# EAGLE design OpenScale (EAGLE 7.2.0)
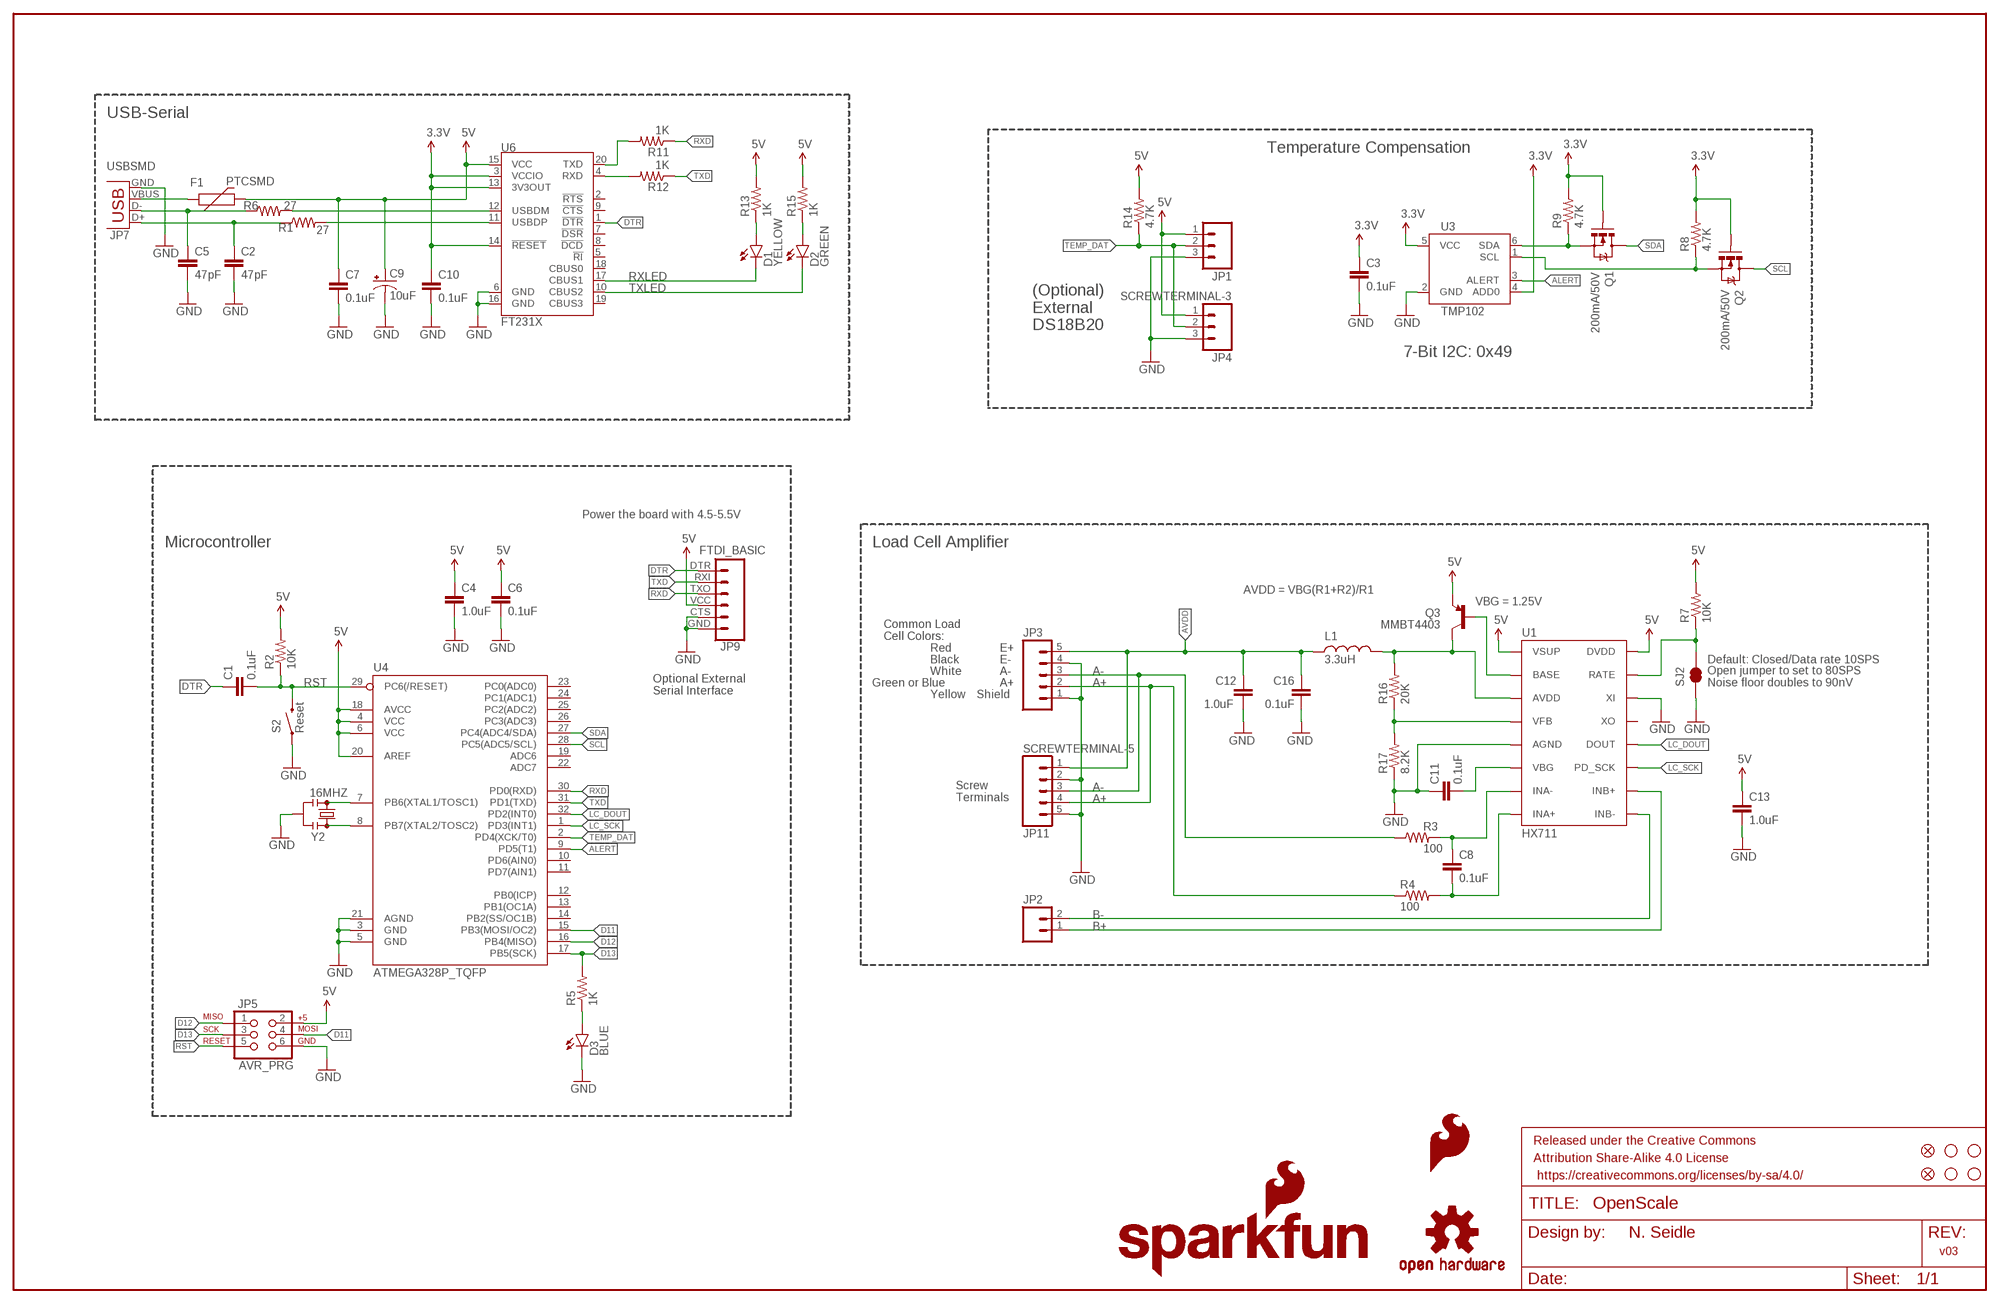
[diagram p0: schematic, sheet 1]

## Parts
C1  0.1uF  0.1UF-25V(+80/-20%)(0603)  [0603-CAP]
C2  47pF  47PF-50V-5%(0603)  [0603-CAP]
C3  0.1uF  0.1UF-25V(+80/-20%)(0603)  [0603-CAP]
C4  1.0uF  1.0UF-16V-10%(0603)  [0603-CAP]
C5  47pF  47PF-50V-5%(0603)  [0603-CAP]
C6  0.1uF  0.1UF-25V(+80/-20%)(0603)  [0603-CAP]
C7  0.1uF  0.1UF-25V(+80/-20%)(0603)  [0603-CAP]
C8  0.1uF  0.1UF-25V(+80/-20%)(0603)  [0603-CAP]
C9  10uF  10UF-16V-10%(TANT)  [EIA3216]
C10  0.1uF  0.1UF-25V(+80/-20%)(0603)  [0603-CAP]
C11  0.1uF  0.1UF-25V(+80/-20%)(0603)  [0603-CAP]
C12  1.0uF  1.0UF-16V-10%(0603)  [0603-CAP]
C13  1.0uF  1.0UF-16V-10%(0603)  [0603-CAP]
C16  0.1uF  0.1UF-25V(+80/-20%)(0603)  [0603-CAP]
D1  YELLOW  LED-YELLOWLARGE  [LED-1206]
D2  GREEN  LED-GREENLARGE  [LED-1206]
D3  BLUE  LED-BLUE1206  [LED-1206]
F1  PTCSMD  [PTC-1206]
FID1  FIDUCIAL1X2  [FIDUCIAL-1X2]
FID2  FIDUCIAL1X2  [FIDUCIAL-1X2]
FRAME1  FRAME-LEDGER  [CREATIVE_COMMONS]
JP1  M031X03_NO_SILK  [1X03_NO_SILK]
JP2  M02PTH  [1X02]
JP3  M05NO_SILK  [1X05_NO_SILK]
JP4  SCREWTERMINAL-3  M03SCREW_LOCK  [SCREWTERMINAL-3.5MM-3_LOCK.007S]
JP5  AVR_PRG  AVR_SPI_PRG_6PTH  [2X3]
JP7  USBSMD  [USB-MINIB]
JP9  FTDI_BASIC  FTDI_BASICPTH  [FTDI_BASIC]
JP11  SCREWTERMINAL-5  M05SCREW  [SCREWTERMINAL-3.5MM-5]
L1  3.3uH  INDUCTOR0805  [0805]
LOGO1  SFE_LOGO_NAME_FLAME.1_INCH  [SFE_LOGO_NAME_FLAME_.1]
LOGO2  OSHW-LOGOS  [OSHW-LOGO-S]
LOGO3  SFE_LOGO_FLAME.1_STOP  [SFE_LOGO_FLAME_STOP_.1]
LOGO4  SFE_LOGO_NAME_FLAME.1_INCH  [SFE_LOGO_NAME_FLAME_.1]
Q1  200mA/50V  MOSFET-NCHANNELBSS138  [SOT23-3]
Q2  200mA/50V  MOSFET-NCHANNELBSS138  [SOT23-3]
Q3  MMBT4403  TRANSISTOR_PNPMMBT4403  [SOT23-3]
R1  27  27OHM1/10W1%(0603)  [0603]
R2  10K  10KOHM-1/10W-1%(0603)0603  [0603-RES]
R3  100  100OHM-1/10W-1%(0603)  [0603-RES]
R4  100  100OHM-1/10W-1%(0603)  [0603-RES]
R5  1K  1KOHM-1/10W-1%(0603)  [0603-RES]
R6  27  27OHM1/10W1%(0603)  [0603]
R7  10K  10KOHM-1/10W-1%(0603)0603  [0603-RES]
R8  4.7K  4.7KOHM-1/10W-1%(0603)  [0603-RES]
R9  4.7K  4.7KOHM-1/10W-1%(0603)  [0603-RES]
R11  1K  1KOHM-1/10W-1%(0603)  [0603-RES]
R12  1K  1KOHM-1/10W-1%(0603)  [0603-RES]
R13  1K  1KOHM-1/10W-1%(0603)  [0603-RES]
R14  4.7K  4.7KOHM-1/10W-1%(0603)  [0603-RES]
R15  1K  1KOHM-1/10W-1%(0603)  [0603-RES]
R16  20K  20KOHM1/10W1%(0603)  [0603-RES]
R17  8.2K  8.2KOHM-1/10W-5%(0603)  [0603-RES]
S2  Reset  SWITCH-MOMENTARY-2SMD-1101NE  [TACTILE-SWITCH-1101NE]
SJ2  JUMPER-PAD-2-NC_BY_TRACE  [PAD-JUMPER-2-NC_BY_TRACE_YES_SILK]
STANDOFF1  STAND-OFF  [STAND-OFF]
STANDOFF2  STAND-OFF  [STAND-OFF]
STANDOFF3  STAND-OFF  [STAND-OFF]
STANDOFF4  STAND-OFF  [STAND-OFF]
U1  HX711  HX711HX711  [SO16]
U3  TMP102  [SOT563]
U4  ATMEGA328P_TQFP  [TQFP32-08]
U6  FT231X  FT231XS  [SSOP20_L]
Y2  16MHZ  RESONATOR16MHZ  [RESONATOR-SMD]

## Nets
3.3V [power]: C3.1 C10.1 Q1.1(G) Q2.1(G) R8.2 R9.2 U3.4(ADD0) U3.5(VCC) U6.3(VCCIO) U6.13(3V3OUT) U6.14(!RESET)
5V: C4.1 C6.1 C7.1 C9.A(+) C13.1 F1.2 JP1.1 JP4.1 JP5.2 JP9.VCC Q3.2(E) R2.2 R7.2 R13.2 R14.2 R15.2 U1.1(VSUP) U1.16(DVDD) U4.4(VCC) U4.6(VCC) U4.18(AVCC) U4.20(AREF) U6.15(VCC)
A+: JP3.2 JP11.4 R4.1
A-: JP3.3 JP11.3 R3.1
ALERT: U3.3(ALERT) U4.9(PD5(T1))
AVDD: C12.2 C16.1 JP3.5 JP11.1 L1.1
B+: JP2.1 U1.10(INB+)
B-: JP2.2 U1.9(INB-)
D11: JP5.4 U4.15(PB3(MOSI/OC2))
D12: JP5.1 U4.16(PB4(MISO))
D13: JP5.3 R5.2 U4.17(PB5(SCK))
DTR: C1.1 JP9.DTR U6.1(!DTR)
GND [power]: C2.2 C3.2 C4.2 C5.2 C6.2 C7.2 C9.C(-) C10.2 C11.1 C12.1 C13.2 C16.2 D3.C JP1.3 JP3.1 JP3.4 JP4.3 JP5.6 JP7.GND JP9.CTS JP9.GND JP11.2 JP11.5 R17.1 S2.1 SJ2.1 U1.5(AGND) U1.14(XI) U3.2(GND) U4.3(GND) U4.5(GND) U4.21(AGND) U6.6(GND) U6.16(GND) Y2.2
LC_DOUT: U1.12(DOUT) U4.32(PD2(INT0))
LC_SCK: U1.11(PD_SCK) U4.1(PD3(INT1))
LV_SCL: Q2.2(S) R8.1 U3.1(SCL)
LV_SDA: Q1.2(S) R9.1 U3.6(SDA)
N$1: U4.7(PB6(XTAL1/TOSC1)) Y2.1
N$2: D3.A R5.1
N$3: U4.8(PB7(XTAL2/TOSC2)) Y2.3
N$4: C5.1 JP7.D- R6.1
N$5: D1.A R13.1
N$6: D2.A R15.1
N$7: C2.1 JP7.D+ R1.1
N$8: R6.2 U6.12(USBDM)
N$9: R7.1 SJ2.2 U1.15(RATE)
N$10: C8.1 R3.2 U1.7(INA-)
N$11: C8.2 R4.2 U1.8(INA+)
N$12: F1.1 JP7.VBUS
N$13: R1.2 U6.11(USBDP)
N$14: R12.2 U6.4(RXD)
N$15: L1.2 Q3.3(C) R16.2 U1.3(AVDD)
N$16: R11.2 U6.20(TXD)
N$17: Q3.1(B) U1.2(BASE)
N$18: R16.1 R17.2 U1.4(VFB)
N$21: C11.2 U1.6(VBG)
RST: C1.2 JP5.5 R2.1 S2.2 U4.29(PC6(/RESET))
RXD: JP9.TXO R11.1 U4.30(PD0(RXD))
RXLED: D1.C U6.17(CBUS1)
SCL: Q2.3(D) U4.28(PC5(ADC5/SCL))
SDA: Q1.3(D) U4.27(PC4(ADC4/SDA))
TEMP_DAT: JP1.2 JP4.2 R14.1 U4.2(PD4(XCK/T0))
TXD: JP9.RXI R12.1 U4.31(PD1(TXD))
TXLED: D2.C U6.10(CBUS2)
Unconnected: U1.13(XO) U4.10(PD6(AIN0)) U4.11(PD7(AIN1)) U4.12(PB0(ICP)) U4.13(PB1(OC1A)) U4.14(PB2(SS/OC1B)) U4.19(ADC6) U4.22(ADC7) U4.23(PC0(ADC0)) U4.24(PC1(ADC1)) U4.25(PC2(ADC2)) U4.26(PC3(ADC3)) U6.2(!RTS) U6.5(!RI) U6.7(!DSR) U6.8(!DCD) U6.9(!CTS) U6.18(CBUS0) U6.19(CBUS3)

## Notes on the sheet
- USB-Serial
- Temperature Compensation
- (Optional)
  External
  DS18B20
- 7-Bit I2C: 0x49
- Power the board with 4.5-5.5V
- Microcontroller | Load Cell Amplifier
- AVDD = VBG(R1+R2)/R1
- VBG = 1.25V
- Common Load
  Cell Colors:
- Red | E+
- Black | E- | Default: Closed/Data rate 10SPS
- White | A-
- Green or Blue | A+
- Open jumper to set to 80SPS
  Noise floor doubles to 90nV
- Optional External
  Serial Interface
- Yellow | Shield
- Screw
  Terminals
- N. Seidle
- v03

## Library data of the parts
C1 C3 C6-C8 C10 C11 C16 = SparkFun-Capacitors:0.1UF-25V(+80/-20%)(0603): CAP-00810 Ceramic Standard decoupling cap; PROD_ID: CAP-00810
C2 C5 = SparkFun-Capacitors:47PF-50V-5%(0603): CAP-08913; PROD_ID: CAP-08913
C4 C12 C13 = SparkFun-Capacitors:1.0UF-16V-10%(0603): CAP-00868; PROD_ID: CAP-00868
C9 = SparkFun-Capacitors:10UF-16V-10%(TANT): CAP-00811 1206/EIA-3216 Tantalum capacitor; PROD_ID: CAP-00811
D1 = SparkFun-LED:LED-YELLOW: Yellow SMD LEDs LilyPad 1206- DIO-09909 0603- DIO-09003 "SMART" means more efficient and expensive; PROD_ID: DIO-00820
D2 = SparkFun-LED:LED-GREEN: Various green LEDs Green LEDs used in SFE Production 0603- DIO-00821 LARGE- DIO-00862 LILYPAD- DIO-09910; PROD_ID: DIO-00862
D3 = SparkFun-LED:LED-BLUE: Blue LEDs for production use Various blue LEDs stocked by SparkFun production 0603 - DIO-08575 Rebel - DIO-09553 1206 - DIO-09911; PROD_ID: DIO-09911
F1 = SparkFun-PowerIC:PTC: Resettable Fuse PTC Resettable Fuse. Spark Fun Electronics SKU : COM-08357; PROD_ID: RES-11150
FID1 FID2 = SparkFun-Aesthetics:FIDUCIAL: Fiducial Alignment Points Various fiducial points for machine vision alignment.
FRAME1 = SparkFun-Aesthetics:FRAME-LEDGER: Schematic Frame Standard 11x14 US Ledger frame; DESIGNER: N. Seidle; VERSION: v02
JP1 = SparkFun-Connectors:M03: Header 3 Standard 3-pin 0.1" header. Use with straight break away headers (SKU : PRT-00116), right angle break away headers (PRT-00553), swiss pins (PRT-00743), machine pins (PRT-00117), and female headers (PRT-00115). Molex polarized connector foot print use with SKU : PRT-08232 with associated crimp pins and housings.
JP2 = SparkFun-Connectors:M02: Standard 2-pin 0.1" header. Use with - straight break away headers ( PRT-00116) - right angle break away headers (PRT-00553) - swiss pins (PRT-00743) - machine pins (PRT-00117) - female headers (PRT-00115) Molex polarized connector foot print use with: PRT-08233 with associated crimp pins and housings. 2.54_SCREWTERM for use with PRT-10571. 3.5mm Screw Terminal footprints for PRT-08084 5mm Screw Terminal footprints for use with PRT-08432
JP3 = SparkFun-Connectors:M05: Header 5 Standard 5-pin 0.1" header. Use with straight break away headers (SKU : PRT-00116), right angle break away headers (PRT-00553), swiss pins (PRT-00743), machine pins (PRT-00117), and female headers (PRT-00115). Molex polarized connector foot print use with SKU : PRT-08230 with associated crimp pins and housings.
JP4 = SparkFun-Connectors:M03: Header 3 Standard 3-pin 0.1" header. Use with straight break away headers (SKU : PRT-00116), right angle break away headers (PRT-00553), swiss pins (PRT-00743), machine pins (PRT-00117), and female headers (PRT-00115). Molex polarized connector foot print use with SKU : PRT-08232 with associated crimp pins and housings.; PROD_ID: CONN-08288
JP5 = SparkFun-Connectors:AVR_SPI_PRG_6: AVR ISP 6 Pin This is the reduced ISP connector for AVR programming. Common on Arduino. This footprint will take up less PCB space and can be used with a 10-pin to 6-pin adapter such as SKU: BOB-08508 **Special note about "TEST_POINT" package. The stop mask is on the top side, so if you want your programming test points to be on the bottom of your board, make sure to place this package on the bottom side of the board. This also ensure that the orientation to program from the bottom side will be correct.
JP7 = SparkFun-Connectors:USB: USB Connectors USB-B-PTH is fully proven SKU : PRT-00139/CONN-08278 USB-miniB is fully proven SKU : PRT-00587 USB-A-PCB is untested. USB-A-H is throughly reviewed, but untested. Spark Fun Electronics SKU : PRT-00437 USB-B-SMT is throughly reviewed, but untested. Needs silkscreen touching up. USB-A-S has not been used/tested USB-MB-H has not been used/tested USB-MICROB has been used. CONN-09505; PROD_ID: CONN-08193
JP9 = SparkFun-Connectors:FTDI_BASIC: FTDI Basic header with labels
JP11 = SparkFun-Connectors:M05: Header 5 Standard 5-pin 0.1" header. Use with straight break away headers (SKU : PRT-00116), right angle break away headers (PRT-00553), swiss pins (PRT-00743), machine pins (PRT-00117), and female headers (PRT-00115). Molex polarized connector foot print use with SKU : PRT-08230 with associated crimp pins and housings.; PROD_ID: Combine 8288+8399
L1 = SparkFun-Passives:INDUCTOR: Inductors Basic Inductor/Choke - 0603 and 1206. Footprints are not proven and vary greatly between part numbers. INDUCTOR POWER 3.3UH 4.0A SMD 0.197" L x 0.197" W x 0.177" H (5.00mm x 5.00mm x 4.50mm)
LOGO1 LOGO4 = SparkFun-Aesthetics:SFE_LOGO_NAME_FLAME: SFE Logo, name and flame This is the SparkFun full logo. The logo on the schematic will always be the same size; the package variant is the height of the flame part of the logo. Default layer for the logo on the board is tSilk.
LOGO2 = SparkFun-Aesthetics:OSHW-LOGO: Open Source Hardware Logo This logo indicates the piece of hardware it is found on incorporates a OSHW license and/or adheres to the definition of open source hardware found here: http://freedomdefined.org/OSHW
LOGO3 = SparkFun-Aesthetics:SFE_LOGO_FLAME: SFE Logo, flame only This is the SparkFun flame logo. The logo on the schematic will always be the same size; the package variant is the height of the flame. Default layer for the logo on the board is tSilk.
Q1 Q2 = SparkFun-DiscreteSemi:MOSFET-NCHANNEL: Common NMOSFET Parts MFG P/N Store ID Prod ID FDD8780 TRANS-09984 SI7820DN TRANS-11055 FDS6630A IC-08089 2N7002PW TRANS-11151 FQP30N06L COM-10213 TRANS-10060 BSS123LT1G TRANS-08345 BSS138 TRANS-00830 BS170 2N7000; PROD_ID: TRANS-00830
Q3 = SparkFun-DiscreteSemi:TRANSISTOR_PNP: Generic PNP BJT Double check pinouts against datasheets- not all devices are the same! MMBT3906 - 40V 200mA SOT-23 (TRANS-08052) MMBT4403 - 40V 600mA SOT-23 (TRANS-09245); PROD_ID: TRANS-09245
R1 R6 = SparkFun-Resistors:27OHM1/10W1%(0603): RES-09334; PROD_ID: RES-09334
R2 R7 = SparkFun-Resistors:10KOHM-1/10W-1%(0603): RES-00824; PROD_ID: RES-00824
R3 R4 = SparkFun-Resistors:100OHM-1/10W-1%(0603): RES-07863; PROD_ID: RES-07863
R5 R11-R13 R15 = SparkFun-Resistors:1KOHM-1/10W-1%(0603): RES-07856; PROD_ID: RES-07856
R8 R9 R14 = SparkFun-Resistors:4.7KOHM-1/10W-1%(0603): RES-07857; PROD_ID: RES-07857
R16 = SparkFun-Resistors:20KOHM1/10W1%(0603): RES-09383; PROD_ID: RES-09383; VALUE: 20k
R17 = SparkFun-Resistors:8.2KOHM-1/10W-5%(0603): RES-10646; PROD_ID: RES-10646
S2 = SparkFun-Electromechanical:SWITCH-MOMENTARY-2: Various NO switches- pushbuttons, reed, etc; PROD_ID: SWCH-00815
SJ2 = SparkFun-Passives:JUMPER-PAD-2-NC_BY_TRACE
STANDOFF1-STANDOFF4 = SparkFun-Electromechanical:STAND-OFF: #4 Stand Off This is the mechanical footprint for a #4 phillips button head screw. Use the keepout ring to avoid running the screw head into surrounding components. SKU : PRT-00447
U1 = Testing:HX711; PROD_ID: IC-12445
U3 = SparkFun-Sensors:TMP102: I2C degC temp sensor; PROD_ID: IC-09303
U4 = SparkFun-DigitalIC:ATMEGA328P_TQFP; PROD_ID: IC-09069
U6 = SparkFun-DigitalIC:FT231X: FTDI FT231X Full Speed USB to Full-handshake UART This USB2.0 Full Speed IC offers a compact bridge to full handshake UART interfaces. The device is a UART, capable of operating up to 3MBaud, with low power consumption (8mA). The FT231X includes the complete FT-X series feature set and enables USB to be added into a system design quickly and easily over a UART interface.; PROD_ID: IC-11524; VALUE: FTS31XS-U
Y2 = SparkFun-FreqCtrl:RESONATOR: Resonator Small SMD resonator. Used, eg, on the Arduino Pro/ Pro Mini boards. 8MHz- XTAL-08895 16MHz- XTAL-08900; PROD_ID: XTAL-08900

## Net classes
1 power: width 0.203 mm

## Board
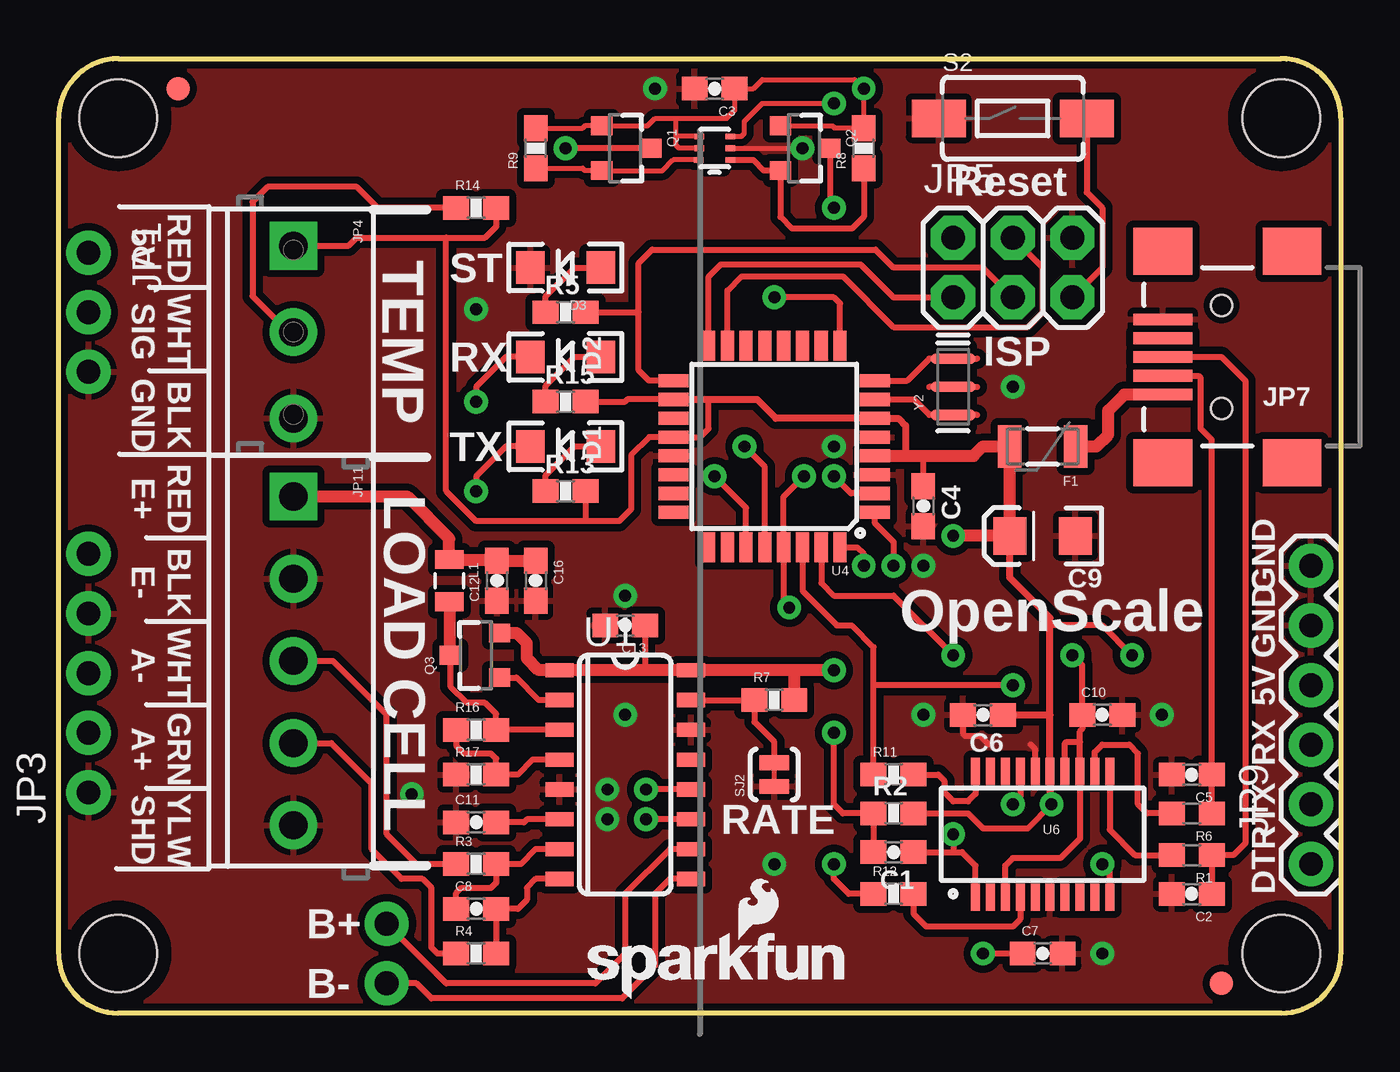
[diagram p1: board, top side]
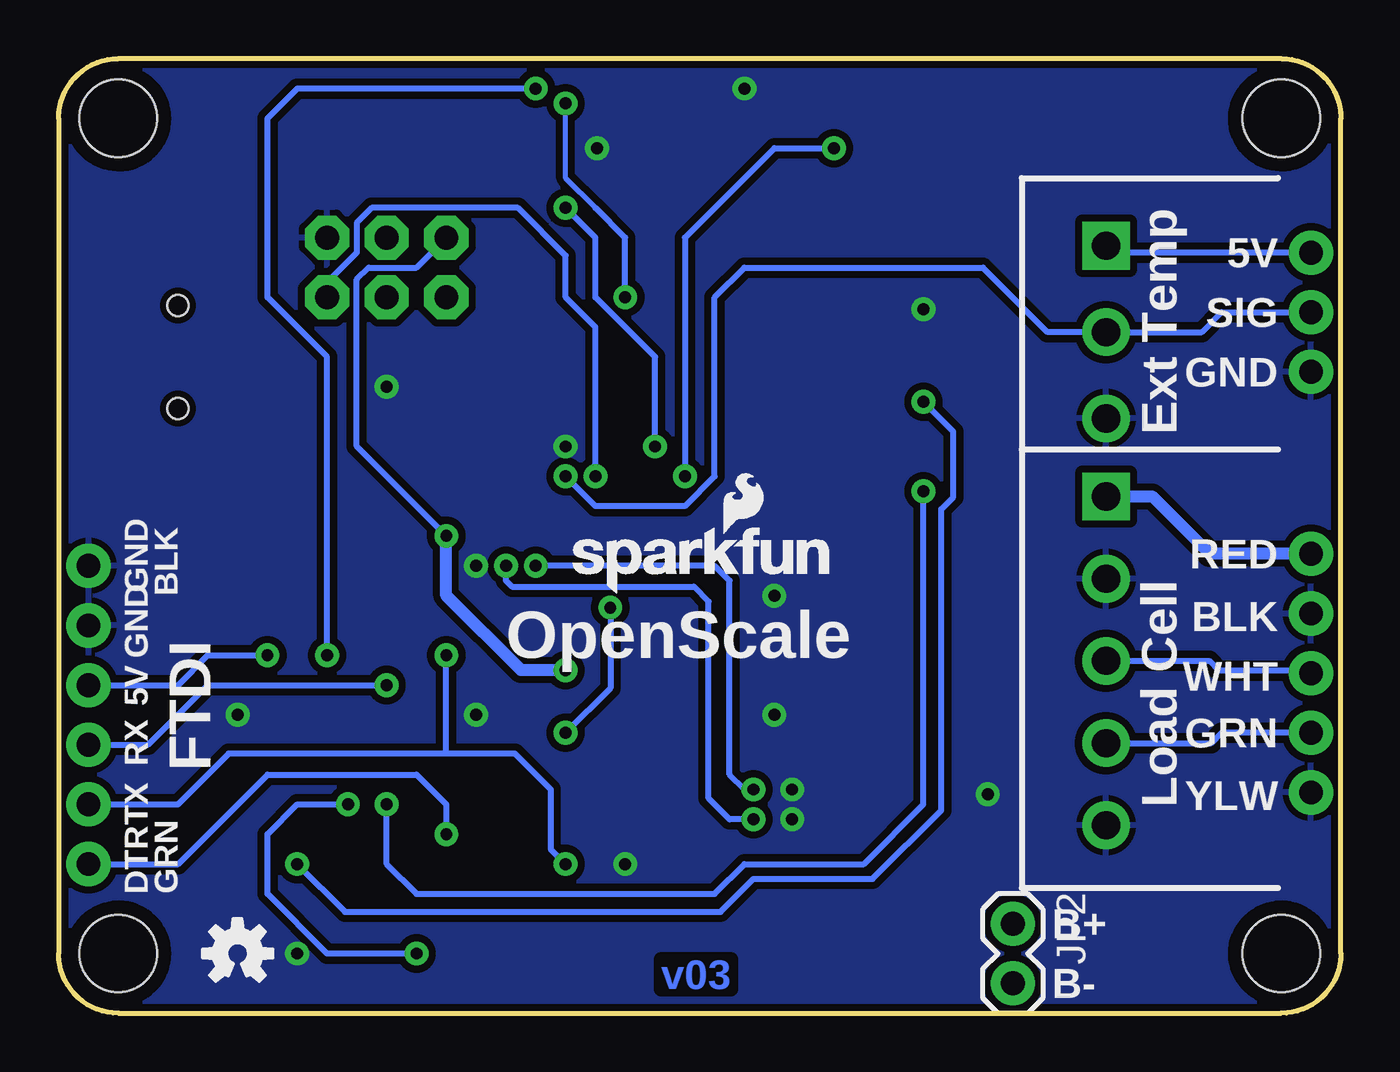
[diagram p2: board, bottom side, seen from below]

Size 54.61 x 40.64 mm. Coordinates in mm from the lower left corner, seen from the top.
Outline: 52.07,0 2.54,0 arc-90 0,2.54 0,38.1 arc-90 2.54,40.64 52.07,40.64 arc-90 54.61,38.1 54.61,2.54 arc-90 52.07,0
Copper layers (1*16): Top 0.035mm / dielectric 1.5mm / Bottom 0.035mm
Design rules "SparkFun-2-layer *": minimum track width 7mil, minimum drill 15mil, track to track 8mil, track to pad 8mil, pad to pad 8mil, via to via 8mil, smd to smd 8mil, copper to edge 8mil, drill to drill 8mil, minimum pad ring 12mil, minimum via ring 10mil, stop-mask expansion 4mil, vias tented up to drill 20mil, thermal gap 10mil
tRestrict: area 27.6,35.9 to 28.3,37.7

### Footprints (pad centres in the part's own frame; a part is rotated, then mirrored left to right if it is on the bottom)
0603-CAP = smd 1.1 x 1: 1 -0.85,0; 2 0.85,0
EIA3216 = smd 1.4 x 1.6: A 1.4,0; C -1.4,0
LED-1206 = smd 1.2 x 1.4: A -1.5,0; C 1.5,0
PTC-1206 = smd 1 x 1.8: 1 -1.4,0; 2 1.4,0
FIDUCIAL-1X2 = smd 1 x 1: 1 0,0
1X03_NO_SILK = drill 1.016 pad 1.88: 1 0,0; 2 2.54,0; 3 5.08,0
1X02 = drill 1.016 pad 1.88: 1 0,0; 2 2.54,0
1X05_NO_SILK = drill 1.016 pad 1.88: 1 0,0; 2 2.54,0; 3 5.08,0; 4 7.62,0; 5 10.16,0
SCREWTERMINAL-3.5MM-3_LOCK.007S = drill 1.2 pad 2.032 square: 1 -0.178,0 | drill 1.2 pad 2.032: 2 3.5,0; 3 7.178,0
2X3 = drill 1.016 pad 1.88 octagon: 1 0,0; 2 0,2.54; 3 2.54,0; 4 2.54,2.54; 5 5.08,0; 6 5.08,2.54
USB-MINIB = smd 2.5 x 0.5: D+ 2.5,0; D- 2.5,0.8; GND 2.5,-1.6; ID 2.5,-0.8; VBUS 2.5,1.6 | smd 2.5 x 2: MTN1 -3,4.5; MTN2 2.5,4.5; MTN3 -3,-4.5; MTN4 2.5,-4.5 | hole 0.9: 0,2.2; 0,-2.2
FTDI_BASIC = drill 1.016 pad 1.88: CTS 10.16,0; DTR 0,0; GND 12.7,0; RXI 2.54,0; TXO 5.08,0; VCC 7.62,0
SCREWTERMINAL-3.5MM-5 = drill 1.2 pad 2.032 square: 1 0,0 | drill 1.2 pad 2.032: 2 3.5,0; 3 7,0; 4 10.5,0; 5 14,0
0805 = smd 0.8 x 1.2: 1 -0.9,0; 2 0.9,0
SOT23-3 = smd 0.8 x 0.9: 1 -0.95,-1; 2 0.95,-1; 3 0,1.1
0603 = smd 1.1 x 1: 1 -0.85,0; 2 0.85,0
0603-RES = smd 1.1 x 1: 1 -0.85,0; 2 0.85,0
TACTILE-SWITCH-1101NE = smd 2.3 x 1.6: 1 -3.15,0; 2 3.15,0
PAD-JUMPER-2-NC_BY_TRACE_YES_SILK = smd 0.635 x 1.27: 1 -0.508,0; 2 0.508,0
STAND-OFF = hole 3.302: 0,0
SO16 = smd 0.6 x 1.2: 1 -4.445,-2.8; 2 -3.175,-2.8; 3 -1.905,-2.8; 4 -0.635,-2.8; 5 0.635,-2.8; 6 1.905,-2.8; 7 3.175,-2.8; 8 4.445,-2.8; 9 4.445,2.8; 10 3.175,2.8; 11 1.905,2.8; 12 0.635,2.8; 13 -0.635,2.8; 14 -1.905,2.8; 15 -3.175,2.8; 16 -4.445,2.8
SOT563 = smd 0.25 x 0.4: 1 -0.5,-0.66; 2 0,-0.66; 3 0.5,-0.66; 4 0.5,0.66; 5 0,0.66; 6 -0.5,0.67
TQFP32-08 = smd 1.27 x 0.559: 1 -4.293,2.8; 2 -4.293,2; 3 -4.293,1.2; 4 -4.293,0.4; 5 -4.293,-0.4; 6 -4.293,-1.2; 7 -4.293,-2; 8 -4.293,-2.8; 17 4.293,-2.8; 18 4.293,-2; 19 4.293,-1.2; 20 4.293,-0.4; 21 4.293,0.4; 22 4.293,1.2; 23 4.293,2; 24 4.293,2.8 | smd 0.559 x 1.27: 9 -2.8,-4.293; 10 -2,-4.293; 11 -1.2,-4.293; 12 -0.4,-4.293; 13 0.4,-4.293; 14 1.2,-4.293; 15 2,-4.293; 16 2.8,-4.293; 25 2.8,4.293; 26 2,4.293; 27 1.2,4.293; 28 0.4,4.293; 29 -0.4,4.293; 30 -1.2,4.293; 31 -2,4.293; 32 -2.8,4.293
SSOP20_L = smd 0.381 x 1.143: 1 -2.857,-2.68; 2 -2.223,-2.68; 3 -1.587,-2.68; 4 -0.953,-2.68; 5 -0.318,-2.68; 6 0.318,-2.68; 7 0.953,-2.68; 8 1.587,-2.68; 9 2.223,-2.68; 10 2.857,-2.68; 11 2.857,2.68; 12 2.223,2.68; 13 1.587,2.68; 14 0.953,2.68; 15 0.318,2.68; 16 -0.318,2.68; 17 -0.953,2.68; 18 -1.587,2.68; 19 -2.223,2.68; 20 -2.857,2.68
RESONATOR-SMD = smd 0.45 x 1.905: 1 -1.2,0; 2 0,0; 3 1.2,0

### Placement (x,y rotation side)
C1  35.56,6.86 180 top
C2  48.26,5.08 180 top
C3  27.94,39.37 180 top
C4  36.83,21.59 270 top
C5  48.26,10.16 180 top
C6  39.37,12.7 180 top
C7  41.91,2.54 0 top
C8  17.78,4.45 0 top
C9  41.91,20.32 180 top
C10  44.45,12.7 0 top
C11  17.78,8.13 0 top
C12  18.67,18.41 90 top
C13  24.13,16.51 180 top
C16  20.32,18.41 270 top
D1  21.59,24.13 180 top
D2  21.59,27.94 180 top
D3  21.59,31.75 180 top
F1  41.91,24.13 180 top
FID1  49.53,1.27 0 top
FID2  5.08,39.37 0 top
FRAME1  0,-7.62 0 top  (outside the outline)
JP1  1.27,32.38 270 top
JP2  13.97,3.81 270 bottom
JP3  1.27,9.4 90 top
JP4  10,32.5 270 top
JP5  38.1,30.48 0 top
JP7  49.53,27.94 180 top
JP9  53.34,6.35 90 top
JP11  10,22 270 top
L1  16.64,18.41 270 top
LOGO1  22.1,0.51 0 top
LOGO2  46.99,2.54 0 bottom
LOGO3  46.48,35.18 0 top
LOGO4  33.15,17.78 0 bottom
Q1  24.13,36.83 270 top
Q2  31.75,36.83 270 top
Q3  17.78,15.24 90 top
R1  48.26,6.73 180 top
R2  35.56,8.51 0 top
R3  17.78,6.35 0 top
R4  17.78,2.54 0 top
R5  21.59,29.84 0 top
R6  48.26,8.51 180 top
R7  30.48,13.34 0 top
R8  34.29,36.83 90 top
R9  20.32,36.83 90 top
R11  35.56,10.16 0 top
R12  35.56,5.08 0 top
R13  21.59,22.23 0 top
R14  17.78,34.29 0 top
R15  21.59,26.04 0 top
R16  17.78,12.06 0 top
R17  17.78,10.16 0 top
S2  40.64,38.1 0 top
SJ2  30.48,10.16 90 top
STANDOFF1  52.07,38.1 0 top
STANDOFF2  52.07,2.54 0 top
STANDOFF3  2.54,2.54 0 top
STANDOFF4  2.54,38.1 0 top
U1  24.13,10.16 270 top
U3  27.94,36.83 90 top
U4  30.48,24.13 180 top
U6  41.91,7.62 0 top
Y2  38.1,26.67 90 top

### Tracks (layer width: path | path; a pad name or v marks a point on that pad's centre or on a via)
3.3V  (via drill 0.51)
  Top 0.203: U3.5 26.42,36.83 26.29,36.96 26.29,37.34 | 26.29,37.34 26.29,38.1 | U3.4 26.3,37.33 26.29,37.34 | R9.2 22.31,37.68 22.41,37.78 Q1.1 25.08,37.78 25.4,38.1 26.29,38.1 | Q2.1 32.96,37.78 33.06,37.68 R8.2 v34.29,39.37 33.91,39.75 29.97,39.75 29.59,39.37 C3.1 28.79,38.44 28.45,38.1 26.29,38.1
  Top 0.254: U6.14 42.86,11.49 42.93,11.56 43.5,11.56 | v43.18,15.24 43.6,14.82 C10.1 43.6,12.1 43.5,12 43.5,11.56 | U6.3 40.32,6.29 40.64,6.6 42.67,6.6 43.5,7.43 U6.13 43.5,11.56
  Bottom 0.254: v43.18,15.24 43.18,27.94 45.72,30.48 45.72,38.1 44.45,39.37 v34.29,39.37
5V  (via drill 0.51)
  Top 0.254: 22.54,26.13 R15.2 24.13,26.04 24.23,26.13 U4.18 | 27.69,26.13 27.69,24.89 27.32,24.53 U4.20 25.16,24.53 24.38,23.75 24.38,21.46 23.88,20.95 22.48,20.95 | C4.1 36.83,23.73 | R13.2 22.44,20.99 22.48,20.95 | C7.1 v39.37,2.54 | R2.2 38.73,8.51 39.37,7.87 41.27,7.87 v42.29,8.89 42.23,8.95 42.23,9.34 | v45.72,15.24 44.45,16.51 42.23,16.51 | 22.48,20.95 17.78,20.95 16.51,22.23 16.51,33.02 | 16.51,33.02 12.7,33.02 12.36,32.68 JP4.1 | 16.51,33.02 18.16,33.02 18.63,33.49 R14.2 | C13.1 24.98,14.69 24.89,14.61
  Top 0.305: 36.07,23.73 36.07,25.02 35.76,25.33 U4.6 30.55,25.33 29.75,26.13 27.69,26.13 U4.18 | 42.23,12.7 U6.15 42.23,9.34 | 42.23,12.7 42.23,16.51 42.23,16.83 40.51,18.55 C9.A | C6.1 42.23,12.7
  Top 0.508: U4.4 36.07,23.73 36.83,23.73 38.97,23.73 39.37,24.13 F1.2 C9.A v38.1,20.32 | v33.02,14.61 31.24,14.61 | 31.24,14.61 U1.16 24.89,14.61 U1.1 20.45,14.61 19.94,15.11 19.94,15.75 19.5,16.19 Q3.2 | R7.2 31.33,14.52 31.24,14.61
  Bottom 0.254: v39.37,2.54 43.18,2.54 45.72,5.08 45.72,7.62 44.45,8.89 v42.29,8.89 | JP9.VCC 49.53,13.97 48.26,15.24 v45.72,15.24 | v38.1,20.32 41.91,24.13 41.91,31.24 41.4,31.75 39.37,31.75 JP5.2 | JP1.1 9.71,32.38 JP4.1
  Bottom 0.508: v33.02,14.61 34.92,14.61 38.1,17.78 v38.1,20.32
A+
  Top 0.254: R4.1 16.13,2.54 15.88,2.79 15.88,5.33 15.49,5.71 14.61,5.71 13.34,6.99 13.34,9.78 11.61,11.5 JP11.4
  Bottom 0.254: JP3.2 5.08,11.94 5.52,11.5 JP11.4
A-
  Top 0.254: R3.1 15.24,6.35 13.97,7.62 13.97,12.7 11.67,15 JP11.3
  Bottom 0.254: JP3.3 1.38,14.59 5.19,14.59 5.6,15 JP11.3
ALERT  (via drill 0.51)
  Top 0.203: U3.3 29.07,37.33 29.21,37.47 29.21,37.97 29.97,38.73 v33.02,38.73
  Top 0.254: U4.9 33.28,30.22 33.02,30.48 v30.48,30.48
  Bottom 0.203: 31.75,34.29 33.02,35.56 v33.02,38.73
  Bottom 0.254: v30.48,30.48 30.48,33.02 31.75,34.29
AVDD
  Top 0.508: JP11.1 14.83,22 16.64,20.19 L1.1 18.62,19.32 C12.2 C16.1
  Bottom 0.508: JP3.5 5.59,19.56 8.03,22 JP11.1
B+
  Top 0.254: U1.10 26.04,6.99 24.13,5.08 24.13,2.54 22.86,1.27 16.51,1.27 JP2.1
B-
  Top 0.254: U1.9 26.04,5.71 25.4,5.08 25.4,2.03 24,0.64 15.88,0.64 15.24,1.27 JP2.2
D11
  Top 0.254: JP5.4 41.91,31.75 41.91,29.84 41.27,29.21 35.56,29.21 33.4,31.37 29.08,31.37 28.48,30.77 U4.15
D12
  Top 0.254: JP5.1 35.56,30.48 34.16,31.88 28.19,31.88 27.68,31.36 U4.16
D13
  Top 0.254: 24.7,29.84 24.7,27.37 25.14,26.93 U4.17 | R5.2 24.7,29.84 | JP5.3 39.37,31.75 35.56,31.75 34.8,32.51 25.27,32.51 24.7,31.94 24.7,29.84
DTR  (via drill 0.51)
  Top 0.254: U6.1 39.05,6.29 38.48,6.86 38.1,6.86 | C1.1 38.1,6.86 | v38.1,7.62 38.1,6.86
  Bottom 0.254: JP9.DTR 49.53,6.35 45.72,10.16 39.37,10.16 38.1,8.89 v38.1,7.62
GND  (via drill 0.51)
  Top 0.203: U3.2 v31.67,36.83
  Top 0.254: U6.16 41.59,11.24 41.4,11.43 | C6.2 38.52,11.9 38.61,11.81 39.24,11.81 39.62,11.43
  other vias: 17.78,29.97 24.13,17.78 23.37,9.53 23.37,8.26 15.04,9.32 30.48,6.35 33.02,24.13 36.83,19.05 46.99,12.7 44.45,2.54 36.83,12.7 40.64,26.67 24.13,12.7 25.4,39.37
  pour Top (isolate 0.305, rank 6): 55.88,40.64 0,40.64 0,0 55.88,0
  pour Bottom (isolate 0.305, rank 6): 55.88,40.64 0,40.64 0,0 55.88,0
LC_DOUT  (via drill 0.51)
  Top 0.254: v34.29,19.05 34.29,19.56 34.01,19.84 U4.32 | U1.12 v25.02,9.53
  Bottom 0.254: v34.29,19.05 26.67,19.05 26.04,18.41 26.04,10.16 25.4,9.53 v25.02,9.53
LC_SCK  (via drill 0.51)
  Top 0.254: v35.56,19.05 35.56,20.07 34.77,20.85 U4.1 | U1.11 v25.02,8.26
  Bottom 0.254: v35.56,19.05 35.56,18.41 35.31,18.16 27.56,18.16 26.92,17.53 26.92,9.14 26.04,8.26 v25.02,8.26
LV_SCL
  Top 0.254: U3.1 29.58,36.33 30.03,35.88 Q2.2 30.75,33.92 30.73,33.91 31.24,33.4 33.78,33.4 34.29,33.91 R8.1
LV_SDA
  Top 0.203: U3.6 26.17,36.33 25.72,35.88 Q1.2 22.41,35.88 22.31,35.98 R9.1
N$1
  Top 0.254: U4.7 36.42,26.13 37.08,25.47
N$2
  Top 0.254: R5.1 20.74,30.52 21.97,31.75 D3.A
N$3
  Top 0.254: U4.8 36.14,26.93 37.08,27.87
N$4
  Top 0.254: R6.1 C5.1 49.11,24.42 48.64,24.89 48.64,27.05 48.55,27.14 JP7.D-
N$5
  Top 0.254: R13.1 20.74,22.9 21.97,24.13 D1.A
N$6
  Top 0.254: R15.1 20.74,26.71 21.97,27.94 D2.A
N$7
  Top 0.254: C2.1 R1.1 50.04,6.73 50.55,7.24 50.55,26.92 49.53,27.94 JP7.D+
N$8
  Top 0.254: R6.2 46.35,8.51 45.97,8.89 45.97,11.05 45.59,11.43 44.45,11.43 44.13,11.11 U6.12
N$9
  Top 0.254: U1.15 R7.1 29.63,12.41 30.48,11.56 SJ2.2
N$10
  Top 0.254: C8.1 16.93,5.12 17.14,5.33 18.41,5.33 18.63,5.55 R3.2 19.68,6.35 20.32,6.99 U1.7
N$11
  Top 0.254: R4.2 C8.2 19.56,4.45 19.94,4.83 19.94,5.33 20.32,5.71 U1.8
N$12
  Top 0.508: JP7.VBUS 45.39,26.34 44.7,25.65 44.7,24.64 44.2,24.13 F1.1
N$13
  Top 0.254: U6.11 44.77,7.81 45.85,6.73 R1.2
N$14
  Top 0.254: U6.4 40.96,4 40.64,3.68 36.96,3.68 36.41,4.23 R12.2
N$15
  Top 0.254: U1.3 R16.2 18.63,12.74 18.16,13.21 17.4,13.21 16.68,13.93 Q3.3 | 16.68,17.43 16.68,17.47 L1.2
  Top 0.508: Q3.3 16.68,17.43
N$16
  Top 0.254: U6.20 39.05,9.34 38.73,9.02 38.1,9.02 37.72,9.4 37.72,9.91 37.47,10.16 R11.2
N$17
  Top 0.254: U1.2 20.45,13.34 19.49,14.29 Q3.1
N$18
  Top 0.254: R16.1 16.93,11.39 17.27,11.05 18.41,11.05 18.63,10.83 R17.2 19.56,10.16 20.19,10.79 U1.4
N$21
  Top 0.254: U1.6 19.94,8.26 19.81,8.13 C11.2
RST  (via drill 0.51)
  Top 0.254: v31.75,22.86 30.88,21.99 U4.29 30.88,17.51 v31.11,17.27 | C1.2 R2.1 33.4,8.51 33.02,8.89 v33.02,11.94 | S2.2 43.79,34.95 44.45,34.29 44.45,31.75 JP5.5
  Bottom 0.254: v31.75,22.86 31.75,29.21 33.02,30.48 33.02,32.26 35.05,34.29 41.27,34.29 41.91,33.66 41.91,32.38 43.18,31.11 JP5.5 | v33.02,11.94 31.11,13.84 v31.11,17.27
RXD  (via drill 0.51)
  Top 0.254: U4.30 31.68,17.98 33.15,16.51 33.78,16.51 34.71,15.58 34.71,13.97 | v40.64,13.97 34.71,13.97 | R11.1 34.71,13.97
  Bottom 0.254: JP9.TXO 50.8,11.43 48.26,13.97 v40.64,13.97
RXLED  (via drill 0.51)
  Top 0.254: D1.C 19.05,24.13 17.78,22.86 v17.78,22.23 | U6.17 40.96,9.21 v40.64,8.89
  Bottom 0.254: v40.64,8.89 40.64,6.35 39.37,5.08 26.67,5.08 25.4,6.35 20.32,6.35 17.78,8.89 v17.78,22.23
SCL  (via drill 0.51)
  Top 0.254: v29.21,24.13 30.08,23.26 U4.28 | Q2.3 32.85,34.46 v33.02,34.29
  Bottom 0.254: v33.02,34.29 31.75,33.02 31.75,30.48 29.21,27.94 v29.21,24.13
SDA  (via drill 0.51)
  Top 0.254: v27.94,22.86 29.28,21.52 U4.27 | Q1.3 v21.59,36.83
  Bottom 0.254: v27.94,22.86 27.94,33.02 24.13,36.83 v21.59,36.83
TEMP_DAT  (via drill 0.51)
  Top 0.254: v33.02,22.86 33.75,22.13 U4.2 | R14.1 13.59,34.29 12.7,35.18 8.89,35.18 8.26,34.54 8.26,30.54 9.79,29 JP4.2
  Bottom 0.254: v33.02,22.86 31.75,21.59 27.94,21.59 26.67,22.86 26.67,30.48 25.4,31.75 15.24,31.75 12.49,29 JP4.2 5.92,29 5.08,29.84 JP1.2
TXD  (via drill 0.51)
  Top 0.254: U4.31 32.48,18.32 33.02,17.78 35.56,17.78 v38.1,15.24 | R12.1 33.66,5.08 33.02,5.71 v33.02,6.35
  Bottom 0.254: v33.02,6.35 33.66,6.99 33.66,9.53 35.18,11.05 38.1,11.05 | 38.1,11.05 v38.1,15.24 | JP9.RXI 49.53,8.89 47.37,11.05 38.1,11.05
TXLED  (via drill 0.51)
  Top 0.254: D2.C 19.05,27.94 17.78,26.67 v17.78,26.04 | U6.10 44.77,6.03 v44.45,6.35
  Bottom 0.254: v17.78,26.04 16.51,24.77 16.51,21.97 17.02,21.46 17.02,8.64 19.94,5.71 25.02,5.71 26.42,4.32 42.42,4.32 v44.45,6.35

### Text on the board
Bottom: v03
tPlace: Reset | RED / 5V | TEMP | ST | WHT / SIG | ISP | RX | BLK / GND | TX | RED / E+ | LOAD CELL | BLK / E- | GND | OpenScale | WHT / A- | GND | 5V | GRN / A+ | RX | YLW / SHD | RATE | TX | DTR | B+ | B-
bPlace: 5V | SIG | GND | Ext Temp | RED | BLK | BLK | GND | FTDI | WHT | OpenScale | GND | GRN | 5V | RX | YLW | Load Cell | TX | GRN | DTR | B+ | B-